# EAGLE design VSOP_DQM_DQE (EAGLE 9.2.1)
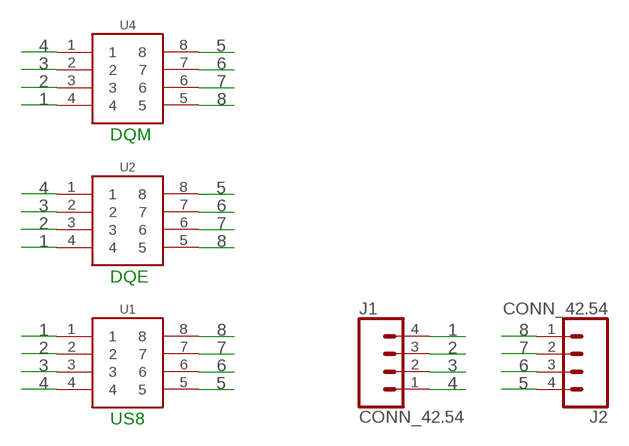
[diagram p0: schematic, sheet 1]

## Parts
J1  CONN_42.54  [1X04]
J2  CONN_42.54  [1X04]
U1  GEN_8VSOP  [DCU_(R-PDSO-G8)]
U2  GEN_8DQE  [DQE_R-PX2SON-N8]
U4  GEN_8DQM  [DQM_R-PX2SON-N8]

## Nets
1: J1.4 U1.1 U2.4 U4.4
2: J1.3 U1.2 U2.3 U4.3
3: J1.2 U1.3 U2.2 U4.2
4: J1.1 U1.4 U2.1 U4.1
5: J2.4 U1.5 U2.8 U4.8
6: J2.3 U1.6 U2.7 U4.7
7: J2.2 U1.7 U2.6 U4.6
8: J2.1 U1.8 U2.5 U4.5

## Notes on the sheet
- DQM
- DQE
- US8

## Library data of the parts
J1 J2 = bschulz:CONN_4: Genaric 4 terminal header Digikey 2.54_SCREW <https://www.digikey.com/product-detail/en/on-shore-technology-inc/OSTVN04A150/ED10563-ND/1588864>
U1 U2 U4 = bschulz:GEN_8: Generic 8 Pin Device

## Board
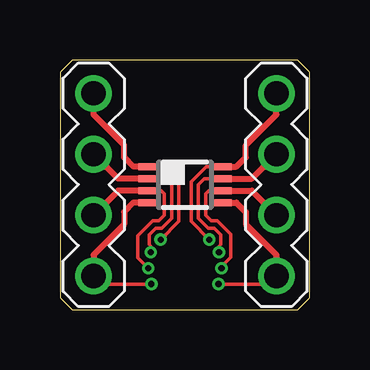
[diagram p1: board, top side]
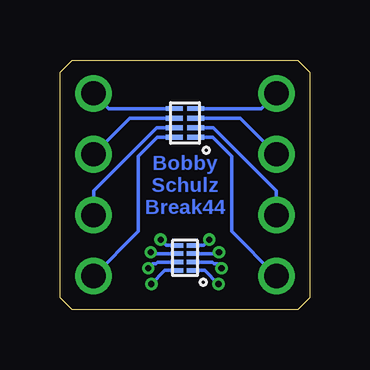
[diagram p2: board, bottom side, seen from below]

Size 10.41 x 10.4 mm. Coordinates in mm from the lower left corner, seen from the top.
Outline: 0,9.9 0,0.5 0.5,0 9.91,0 10.41,0.5 10.41,9.9 9.91,10.4 0.5,10.4 0,9.9
Copper layers (1*16): Top 0.035559375mm / dielectric 1.6mm / Bottom 0.035559375mm
Design rules "oshpark-2layer": minimum track width 6mil, minimum drill 10mil, track to track 6mil, track to pad 6mil, pad to pad 6mil, via to via 6mil, smd to smd 6mil, copper to edge 15mil, drill to drill 6mil, minimum pad ring 5mil, minimum via ring 5mil, stop-mask expansion 2.5mil, vias tented up to drill 0mil, thermal gap 10mil

### Footprints (pad centres in the part's own frame; a part is rotated, then mirrored left to right if it is on the bottom)
1X04 = drill 1.016: 1 -3.81,0; 2 -1.27,0; 3 1.27,0; 4 3.81,0
DCU_(R-PDSO-G8) = smd 0.3 x 0.8: 1 -0.75,-1.55; 2 -0.25,-1.55; 3 0.25,-1.55; 4 0.75,-1.55; 5 0.75,1.55; 6 0.25,1.55; 7 -0.25,1.55; 8 -0.75,1.55
DQE_R-PX2SON-N8 = smd 0.19 x 0.51: 1 -0.525,-0.335; 2 -0.175,-0.335; 3 0.175,-0.335; 4 0.525,-0.335; 5 0.525,0.335; 6 0.175,0.335; 7 -0.175,0.335; 8 -0.525,0.335
DQM_R-PX2SON-N8 = smd 0.2 x 0.7: 1 -0.6,-0.45; 2 -0.2,-0.45; 3 0.2,-0.45; 4 0.6,-0.45; 5 0.6,0.45; 6 0.2,0.45; 7 -0.2,0.45; 8 -0.6,0.45

### Placement (x,y rotation side)
J1  1.4,5.21 90 top
J2  9.02,5.21 270 top
U1  5.21,5.21 270 top
U2  5.21,2.16 90 bottom
U4  5.21,7.78 90 bottom

### Tracks (layer width: path | path; a pad name or v marks a point on that pad's centre or on a via)
1  (via drill 0.25)
  Top 0.152: U1.1 4.33,5.96 4.95,5.33 4.95,3.68 v4.19,2.92
  Top 0.254: U1.1 3.06,5.96 2.67,6.35 2.67,6.86 1.4,8.13 J1.4
  Bottom 0.152: U4.4 2.03,8.38 J1.4 | U2.4 4.43,2.68 v4.19,2.92
2  (via drill 0.25)
  Top 0.152: U1.2 4.4,5.46 4.65,5.21 4.65,3.81 4.24,3.4 3.99,3.4 3.71,3.12 3.71,2.72 3.79,2.64 v3.79,2.39
  Top 0.254: U1.2 2.42,5.46 J1.3
  Bottom 0.152: U4.3 2.9,7.98 J1.3 | U2.3 3.84,2.33 v3.79,2.39
3  (via drill 0.25)
  Top 0.152: U1.3 4.21,4.96 4.34,4.83 4.34,3.94 4.12,3.71 3.87,3.71 3.24,3.08 3.24,2.17 v3.68,1.73
  Top 0.254: U1.3 2.42,4.96 J1.2
  Bottom 0.152: U4.2 4.03,7.58 1.4,4.95 J1.2 | U2.2 4.06,1.98 3.99,1.91 3.86,1.91 v3.68,1.73
4  (via drill 0.25)
  Top 0.152: v3.81,1.07 1.72,1.07 J1.1
  Top 0.254: U1.4 3.06,4.46 2.67,4.06 2.67,3.56 1.4,2.29 J1.1
  Bottom 0.152: U4.1 4.06,7.18 3.26,6.39 3.26,3.26 J1.1 | U2.1 4.37,1.63 v3.81,1.07
5  (via drill 0.25)
  Top 0.152: v6.6,1.07 8.69,1.07 J2.4
  Top 0.254: U1.5 7.35,4.46 7.75,4.06 7.75,3.56 9.02,2.29 J2.4
  Bottom 0.152: U4.8 6.36,7.18 7.15,6.39 7.15,3.26 J2.4 | U2.8 6.04,1.63 v6.6,1.07
6  (via drill 0.25)
  Top 0.152: v6.73,1.73 6.73,1.81 7.11,2.19 7.11,3.15 6.55,3.71 6.3,3.71 6.07,3.94 6.07,4.83 6.2,4.96 U1.6
  Top 0.254: U1.6 8,4.96 J2.3
  Bottom 0.152: U4.7 6.39,7.58 9.02,4.95 J2.3 | U2.7 6.35,1.98 6.43,1.91 6.55,1.91 v6.73,1.73
7  (via drill 0.25)
  Top 0.152: v6.63,2.39 6.63,2.64 6.71,2.72 6.71,3.12 6.42,3.4 6.17,3.4 5.77,3.81 5.77,5.21 6.01,5.46 U1.7
  Top 0.254: U1.7 8,5.46 J2.2
  Bottom 0.152: U4.6 7.51,7.98 J2.2 | U2.6 6.57,2.33 v6.63,2.39
8  (via drill 0.25)
  Top 0.152: v6.22,2.92 5.46,3.68 5.46,5.33 6.08,5.96 U1.8
  Top 0.254: U1.8 7.35,5.96 7.75,6.35 7.75,6.86 9.02,8.13 J2.1
  Bottom 0.152: U4.5 8.38,8.38 J2.1 | U2.5 5.99,2.68 v6.22,2.92

### Text on the board
Bottom: Bobby / Schulz / Break44
tDocu: 1 | 8 | 2 | 7 | 3 | VSOP | 6 | MS8 | 4 | 5
bDocu: 5 | DQM | 4 | 6 | 3 | 7 | 2 | DQE | 8 | 1